# Altium schematic sheet 01-Chopper-CD.SchDoc
size C; DocumentNumber: 2; SheetNumber: 2; SheetTotal: 4
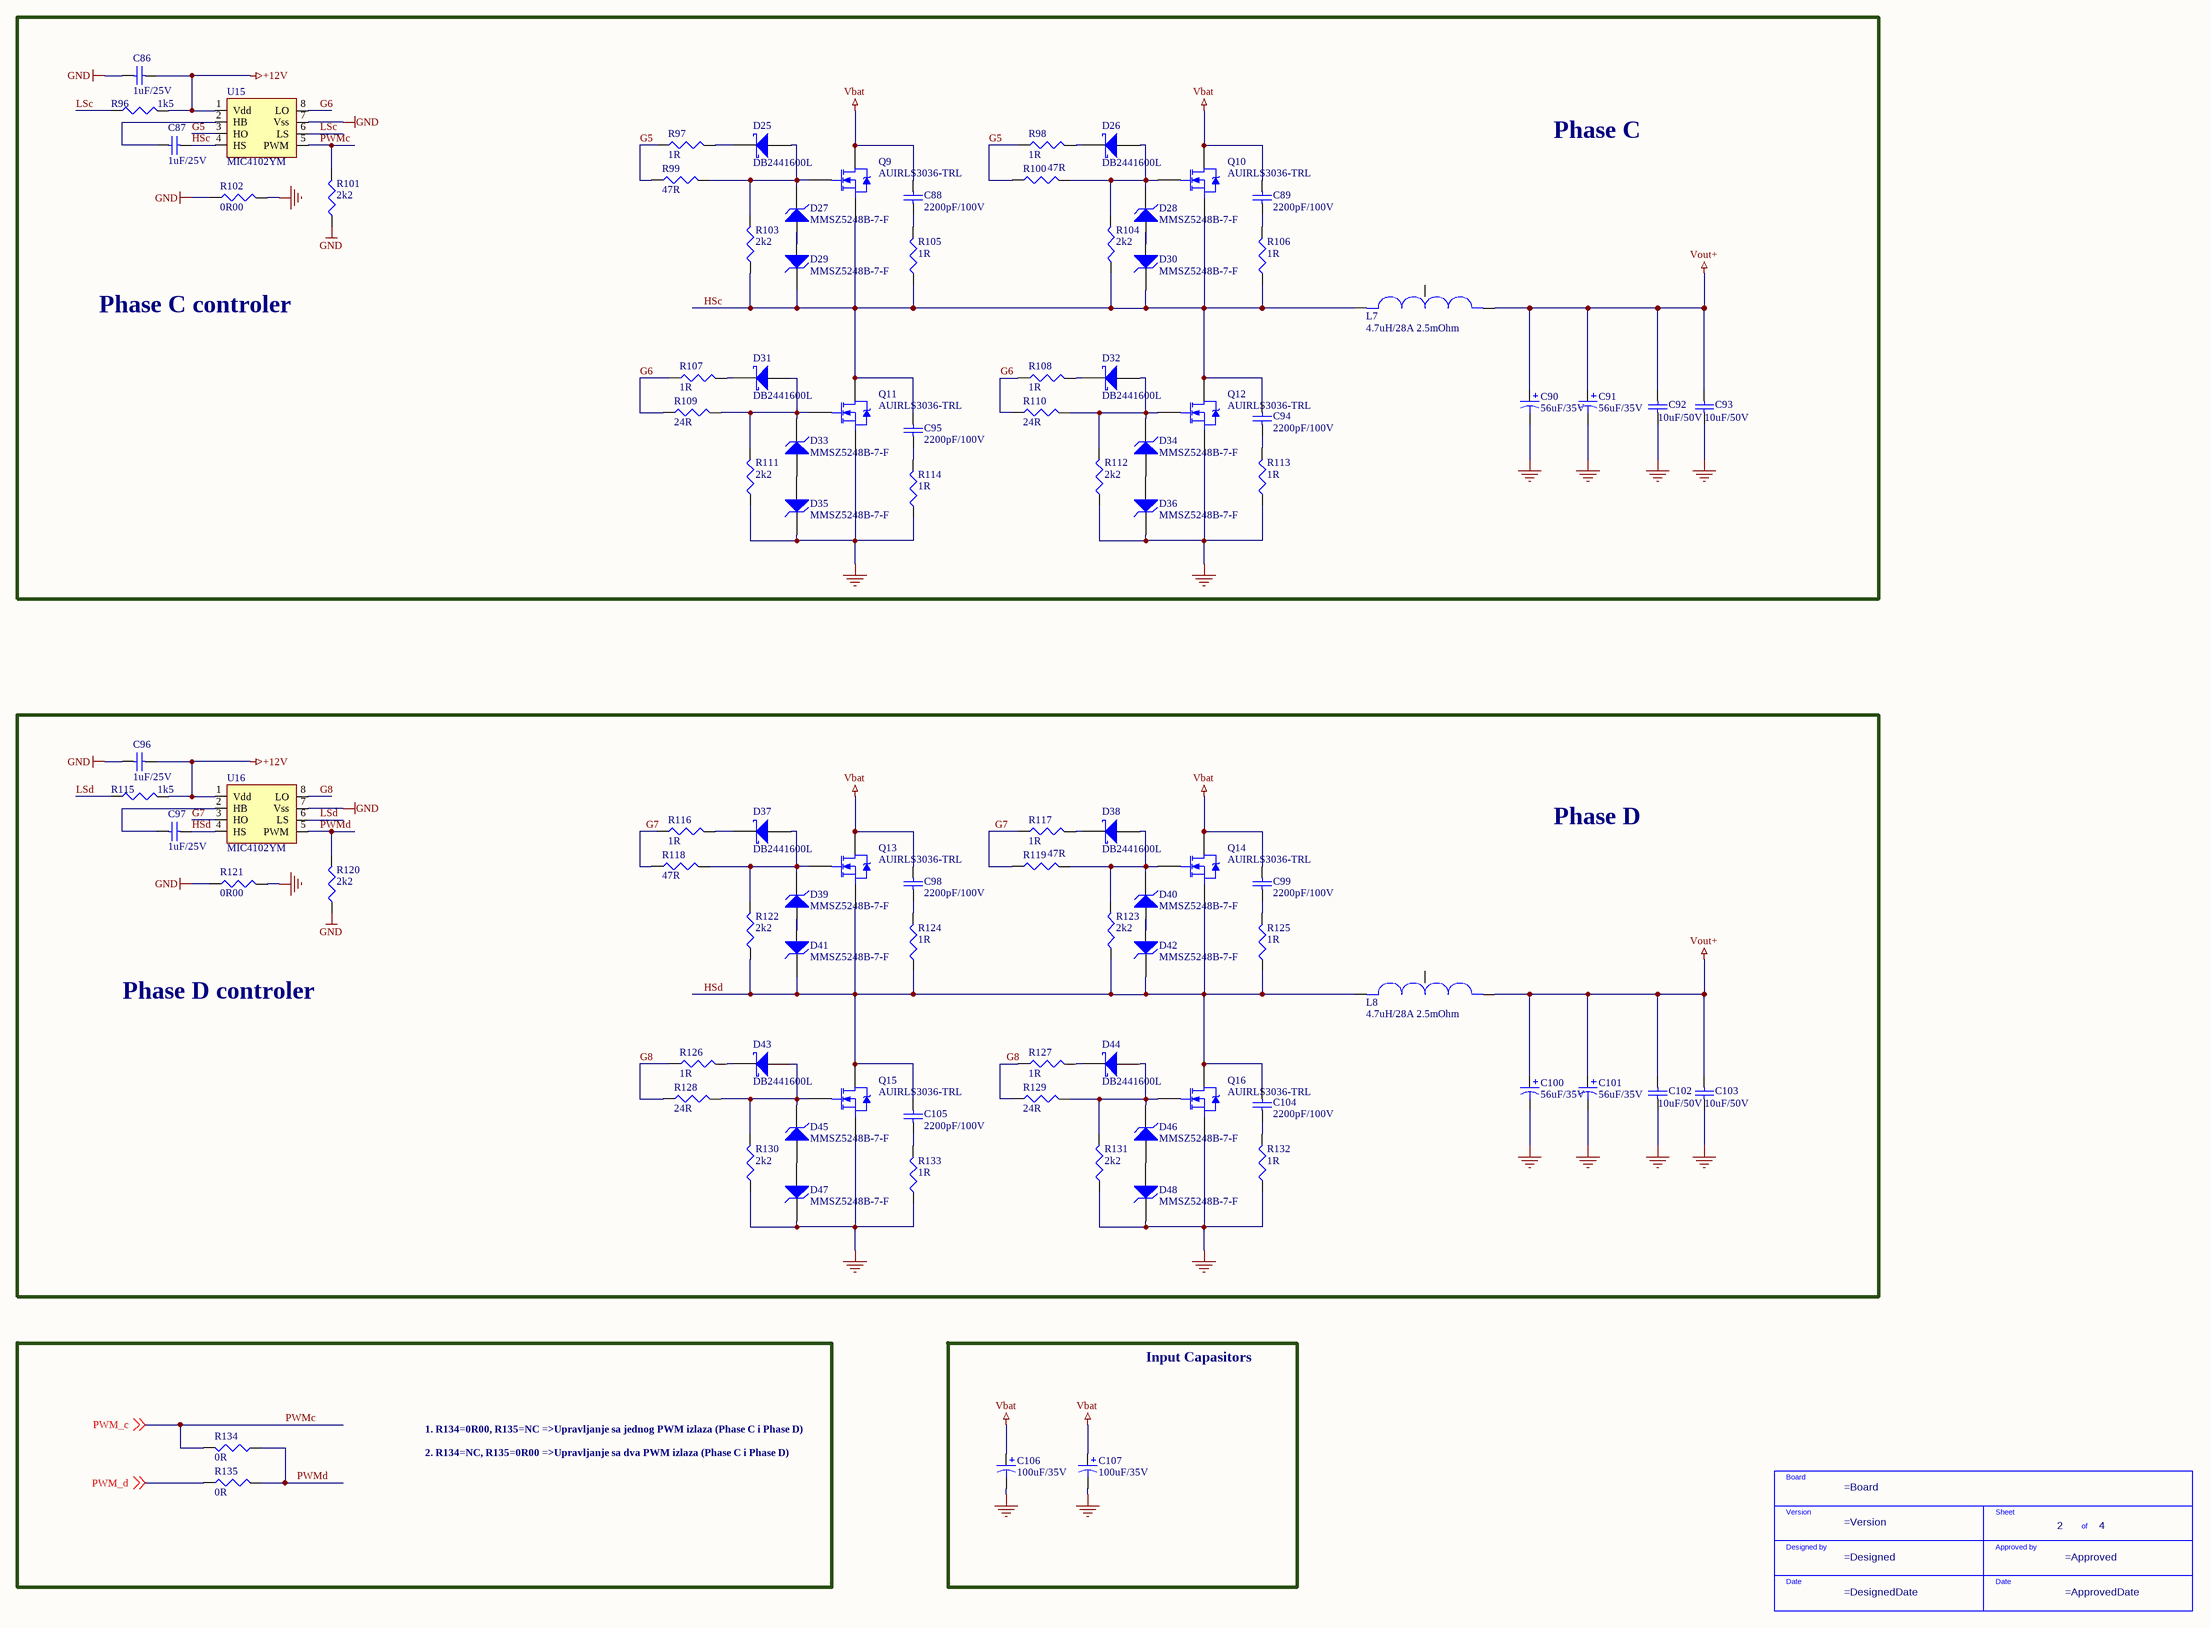
[diagram p0: 01-Chopper-CD.SchDoc]

## Parts
C86  1uF/25V  [CAPC2013X14N]
C87  1uF/25V  [CAPC2013X14N]
C88  2200pF/100V  [DiscCapacitorSnuber]
C89  2200pF/100V  [DiscCapacitorSnuber]
C90  56uF/35V  [CAPAE10184X100M]
C91  56uF/35V  [CAPAE10184X100M]
C92  10uF/50V  [CAPC3426X27N]
C93  10uF/50V  [CAPC3426X27N]
C94  2200pF/100V  [DiscCapacitorSnuber]
C95  2200pF/100V  [DiscCapacitorSnuber]
C96  1uF/25V  [CAPC2013X14N]
C97  1uF/25V  [CAPC2013X14N]
C98  2200pF/100V  [DiscCapacitorSnuber]
C99  2200pF/100V  [DiscCapacitorSnuber]
C100  56uF/35V  [CAPAE10184X100M]
C101  56uF/35V  [CAPAE10184X100M]
C102  10uF/50V  [CAPC3426X27N]
C103  10uF/50V  [CAPC3426X27N]
C104  2200pF/100V  [DiscCapacitorSnuber]
C105  2200pF/100V  [DiscCapacitorSnuber]
C106  100uF/35V  [CAPAE8884X86M]
C107  100uF/35V  [CAPAE8884X86M]
D25  DB2441600L  [DIOM4824X10N]
D26  DB2441600L  [DIOM4824X10N]
D27  MMSZ5248B-7-F  [DIOM3715X14N]
D28  MMSZ5248B-7-F  [DIOM3715X14N]
D29  MMSZ5248B-7-F  [DIOM3715X14N]
D30  MMSZ5248B-7-F  [DIOM3715X14N]
D31  DB2441600L  [DIOM4824X10N]
D32  DB2441600L  [DIOM4824X10N]
D33  MMSZ5248B-7-F  [DIOM3715X14N]
D34  MMSZ5248B-7-F  [DIOM3715X14N]
D35  MMSZ5248B-7-F  [DIOM3715X14N]
D36  MMSZ5248B-7-F  [DIOM3715X14N]
D37  DB2441600L  [DIOM4824X10N]
D38  DB2441600L  [DIOM4824X10N]
D39  MMSZ5248B-7-F  [DIOM3715X14N]
D40  MMSZ5248B-7-F  [DIOM3715X14N]
D41  MMSZ5248B-7-F  [DIOM3715X14N]
D42  MMSZ5248B-7-F  [DIOM3715X14N]
D43  DB2441600L  [DIOM4824X10N]
D44  DB2441600L  [DIOM4824X10N]
D45  MMSZ5248B-7-F  [DIOM3715X14N]
D46  MMSZ5248B-7-F  [DIOM3715X14N]
D47  MMSZ5248B-7-F  [DIOM3715X14N]
D48  MMSZ5248B-7-F  [DIOM3715X14N]
L7  4.7uH/28A 2.5mOhm  [BournsInductor_4.7uH]
L8  4.7uH/28A 2.5mOhm  [BournsInductor_4.7uH]
Q9  AUIRLS3036-TRL  [DPAK127P1524X483-7N]
Q10  AUIRLS3036-TRL  [DPAK127P1524X483-7N]
Q11  AUIRLS3036-TRL  [DPAK127P1524X483-7N]
Q12  AUIRLS3036-TRL  [DPAK127P1524X483-7N]
Q13  AUIRLS3036-TRL  [DPAK127P1524X483-7N]
Q14  AUIRLS3036-TRL  [DPAK127P1524X483-7N]
Q15  AUIRLS3036-TRL  [DPAK127P1524X483-7N]
Q16  AUIRLS3036-TRL  [DPAK127P1524X483-7N]
R96  1k5  [RESC2914X05N]
R97  1R  [RESC2914X05N]
R98  1R  [RESC2914X05N]
R99  47R  [RESC2914X05N]
R100  47R  [RESC2914X05N]
R101  2k2  [RESC2914X05N]
R102  0R00  [RESC2914X05N]
R103  2k2  [RESC2914X05N]
R104  2k2  [RESC2914X05N]
R105  1R  [RESC6432X08N]
R106  1R  [RESC6432X08N]
R107  1R  [RESC2914X05N]
R108  1R  [RESC2914X05N]
R109  24R  [RESC2914X05N]
R110  24R  [RESC2914X05N]
R111  2k2  [RESC2914X05N]
R112  2k2  [RESC2914X05N]
R113  1R  [RESC6432X08N]
R114  1R  [RESC6432X08N]
R115  1k5  [RESC2914X05N]
R116  1R  [RESC2914X05N]
R117  1R  [RESC2914X05N]
R118  47R  [RESC2914X05N]
R119  47R  [RESC2914X05N]
R120  2k2  [RESC2914X05N]
R121  0R00  [RESC2914X05N]
R122  2k2  [RESC2914X05N]
R123  2k2  [RESC2914X05N]
R124  1R  [RESC6432X08N]
R125  1R  [RESC6432X08N]
R126  1R  [RESC2914X05N]
R127  1R  [RESC2914X05N]
R128  24R  [RESC2914X05N]
R129  24R  [RESC2914X05N]
R130  2k2  [RESC2914X05N]
R131  2k2  [RESC2914X05N]
R132  1R  [RESC6432X08N]
R133  1R  [RESC6432X08N]
R134  0R  [R0805]
R135  0R  [R0805]
STB?  -  (value not drawn)  (graphical)
U15  MIC4102YM  [SOIC127P610X173-8N]
U16  MIC4102YM  [SOIC127P610X173-8N]

## Blocks framed on the sheet
Input Capasitors: C106 C107

## Nets
+12V: C86.2 C96.2 R96.2 R115.2 U15.1(Vdd) U16.1(Vdd)
GND: C86.1 C96.1 R101.1 R102.1 R120.1 R121.1 U15.7(Vss) U16.7(Vss)
P_GND: C90.2 C91.2 C92.1 C93.1 C100.2 C101.2 C102.1 C103.1 C106.2 C107.2 D35.2(K) D36.2(K) D47.2(K) D48.2(K) Q11.3(S) Q12.3(S) Q15.3(S) Q16.3(S) R102.2 R111.1 R112.1 R113.1 R114.1 R121.2 R130.1 R131.1 R132.1 R133.1
Vbat: C88.2 C89.2 C98.2 C99.2 C106.1 C107.1 Q9.2(D) Q10.2(D) Q13.2(D) Q14.2(D)
Vout+: C90.1 C91.1 C92.2 C93.2 C100.1 C101.1 C102.2 C103.2 L7.2 L8.2
G5: R97.1 R98.1 R99.1 R100.1 U15.3(HO)
G6: R107.1 R108.1 R109.1 R110.1 U15.8(LO)
G7: R116.1 R117.1 R118.1 R119.1 U16.3(HO)
G8: R126.1 R127.1 R128.1 R129.1 U16.8(LO)
HSc: C87.1 C94.2 C95.2 D29.2(K) D30.2(K) L7.1 Q9.3(S) Q10.3(S) Q11.2(D) Q12.2(D) R103.1 R104.1 R105.1 R106.1 U15.4(HS)
HSd: C97.1 C104.2 C105.2 D41.2(K) D42.2(K) L8.1 Q13.3(S) Q14.3(S) Q15.2(D) Q16.2(D) R122.1 R123.1 R124.1 R125.1 U16.4(HS)
LSc: R96.1 U15.6(LS)
LSd: R115.1 U16.6(LS)
PWM_d: R135.1 ; off-sheet PWM_d
PWMc: R101.2 R134.2 U15.5(PWM) ; off-sheet PWM_c  [also labelled PWM_c]
PWMd: R120.2 R134.1 R135.2 U16.5(PWM)
NetC87_2: C87.2 U15.2(HB)
NetC88_1: C88.1 R105.2
NetC89_1: C89.1 R106.2
NetC94_1: C94.1 R113.2
NetC95_1: C95.1 R114.2
NetC97_2: C97.2 U16.2(HB)
NetC98_1: C98.1 R124.2
NetC99_1: C99.1 R125.2
NetC104_1: C104.1 R132.2
NetC105_1: C105.1 R133.2
NetD25_1: D25.1(A) D27.2(K) Q9.1(G) R99.2 R103.2
NetD25_2: D25.2(K) R97.2
NetD26_1: D26.1(A) D28.2(K) Q10.1(G) R100.2 R104.2
NetD26_2: D26.2(K) R98.2
NetD27_1: D27.1(A) D29.1(A)
NetD28_1: D28.1(A) D30.1(A)
NetD31_1: D31.1(A) D33.2(K) Q11.1(G) R109.2 R111.2
NetD31_2: D31.2(K) R107.2
NetD32_1: D32.1(A) D34.2(K) Q12.1(G) R110.2 R112.2
NetD32_2: D32.2(K) R108.2
NetD33_1: D33.1(A) D35.1(A)
NetD34_1: D34.1(A) D36.1(A)
NetD37_1: D37.1(A) D39.2(K) Q13.1(G) R118.2 R122.2
NetD37_2: D37.2(K) R116.2
NetD38_1: D38.1(A) D40.2(K) Q14.1(G) R119.2 R123.2
NetD38_2: D38.2(K) R117.2
NetD39_1: D39.1(A) D41.1(A)
NetD40_1: D40.1(A) D42.1(A)
NetD43_1: D43.1(A) D45.2(K) Q15.1(G) R128.2 R130.2
NetD43_2: D43.2(K) R126.2
NetD44_1: D44.1(A) D46.2(K) Q16.1(G) R129.2 R131.2
NetD44_2: D44.2(K) R127.2
NetD45_1: D45.1(A) D47.1(A)
NetD46_1: D46.1(A) D48.1(A)

Not connected (* = marked no-connect by the designer): L7 3; L8 3

## Notes on the sheet
- Phase C
- Phase C controler
- Phase D
- Phase D controler
- 1. R134=0R00, R135=NC =>Upravljanje sa jednog PWM izlaza (Phase C i Phase D)
- 2. R134=NC, R135=0R00 =>Upravljanje sa dva PWM izlaza (Phase C i Phase D)
- (in symbol Schematic Title Block) Board; Version; Sheet; of; Designed by; Approved by; Date

## Library data of the parts
C86 C87 C96 C97 = CL21B105KAFNNNG: 1µF ±10% 25V Ceramic Capacitor X7R 0805 (2012 Metric); Manufacturer: Samsung Electro-Mechanics; Type: SMD; Manufacturer Part Number: CL21B105KAFNNNG; Package: CAPC2012X88N; Category: Capasitor; Max Rated Voltage: 25V; Temperature coefficient: X7R; Supplier1: Digi-key; Supplier part number: 1276-6469-2-ND; ComponentLink1Description: Datasheet; ComponentLink1URL: http://www.samsungsem.com/kr/support/product-search/mlcc/__icsFiles/afieldfile/2019/06/18/CL21B105KAFNNNG-19.pdf; Tolerance: 10%
C88 C89 C94 C95 C98 C99 C104 C105 = D222K25Y5PH63J5R: D222K25Y5PH63J5R -  Ceramic Disc Capacitor, 2200 pF, 100 V, D Series, ± 10%, Y5P, 5 mm; Manufacturer: Vishay; Max Rated Voltage: 100V; Type: THT; Manufacturer Part Number: D222K25Y5PH63J5R; Package: *; Category: Capasitor; Dielectric Characteristic: Y5P; Supplier1: Farnell; Supplier part number: 1827838; Tolerance: 10%; ComponentLink1Description: Datasheet; ComponentLink1URL: http://www.farnell.com/datasheets/2046069.pdf?_ga=2.161221557.908146518.1581324380-437978810.1505463394
C90 C91 C100 C101 = PCV1V560MCL1GS: 56µF 35V Aluminum Polymer Capacitor Radial, Can - SMD 31mOhm 3000 Hrs @ 105°C; Manufacturer: Nichicon; Ripple Current: 1.9A; ESR (Equivalent Series Resistance): 31mR; Capacitance: 56uF; Tolerance: 20%; Leakage Current: 700uA; Life (Hours): 2000Hour; Dissipation Factor: 0.12%; Supplier 1: Mouser; Manufacturer Part Number: PCV1V560MCL1GS; Stock 1: 2294; Pricing 1: 1=2.74, 10=2.25, 25=2.19, 100=1.75, 250=1.66, 500=1.19 (USD); Mount: Surface Mount; Case/Package: SMD/SMT; Min Operating Temperature: -55°C; Max Operating Temperature: 105°C; Packaging: Tape and Reel; Voltage Rating: 35V; Package Quantity: 1; Ripple Current (AC): 1.9A; Voltage Rating (DC): 35V; Termination: SMD/SMT; Diameter: 8mm; Length: 8.3mm; Height: 8.3mm; Width: 8.3mm; Height - Seated (Max): 0.394inch; REACH SVHC: No SVHC; Supplier Part Number 1: 647-RHS1V101MCN1GS; Category: Capacitors; ComponentLink1Description: Datasheet; ComponentLink1URL: https://eu.mouser.com/datasheet/2/293/e-pcv-884151.pdf
C92 C93 C102 C103 = UMK325C7106MM-T: 10µF ±20% 50V Ceramic Capacitor X7S 1210 (3225 Metric); Manufacturer: Taiyo Yuden; Type: SMD; Manufacturer Part Number: UMK325C7106MM-T; Package: CAPC3225X125N; Category: Capasitor; Max Rated Voltage: 50 V; Dielectric Characteristic: X7S; Supplier1: Digikey; Supplier part number: 587-1818-2-ND; Tolerance: 20%; ComponentLink1Description: Datasheet; ComponentLink1URL: https://media.digikey.com/pdf/Data%20Sheets/Taiyo%20Yuden%20PDFs%20URL%20links/UMK325C7106MM-T.pdf
C106 C107 = RHS1V101MCN1GS: NICHICON         RHS1V101MCN1GS             ALUMINUM ELECTROLYTIC CAPACITOR, 100UF, 20%, 35V, SMD; Ripple Current: 3A; ESR (Equivalent Series Resistance): 25mR; Leakage Current: 700uA; Life (Hours): 2000Hour; Dissipation Factor: 0.12%; Supplier 1: Mouser; Manufacturer: Nichicon; Manufacturer Part Number: RHS1V101MCN1GS; Stock 1: 2294; Pricing 1: 1=2.74, 10=2.25, 25=2.19, 100=1.75, 250=1.66, 500=1.19 (USD); Mount: Surface Mount; Case/Package: SMD/SMT; Min Operating Temperature: -55°C; Max Operating Temperature: 105°C; Packaging: Tape and Reel; Capacitance: 100uF; Tolerance: 20%; Voltage Rating: 35V; Package Quantity: 1; Ripple Current (AC): 3A; Voltage Rating (DC): 35V; Termination: SMD/SMT; Diameter: 8mm; Length: 8.7mm; Height: 8.3mm; Width: 8.3mm; Height - Seated (Max): 0.354inch; REACH SVHC: No SVHC; ComponentLink1URL: https://eu.mouser.com/datasheet/2/293/e-rhs_rha-1513422.pdf; ComponentLink1Description: Datasheet; Supplier Part Number 1: 647-RHS1V101MCN1GS; Category: Capacitors
D25 D26 D31 D32 D37 D38 D43 D44 = DB2441600L: Diodes - General Purpose, Power, Switching Schottky Barrier Diode; Manufacturer: Panasonic; Peak Reverse Voltage: 40 V; Max Surge Current: 50 A; Forward Current: 3 A; Type: SMD; Manufacturer Part Number: DB2441600L; Package: *; Category: Shottky; Supplier1: Mouser; Supplier part number: 667-DB2441600L; ComponentLink1Description: Datasheet; ComponentLink1URL: https://eu.mouser.com/datasheet/2/315/DB2441600L_E-1141476.pdf
D27-D30 D33-D36 D39-D42 D45-D48 = MMSZ5248B-7-F: Diodes Inc, 18V Zener Diode 5% 500 mW SMT 2-Pin SOD-123; Manufacturer: Diode Zetex; Maximum Power Dissipation: 500 mW; Test Current: 7 mA; Type: SMD; Manufacturer Part Number: MMSZ5248B-7-F; Package: SOD3716X135N; Category: Zener diode; Nominal Zener Voltage: 18 V; Supplier1: RS Components; Supplier part number: 121-9610; ComponentLink1Description: Datasheet; ComponentLink1URL: https://eu.mouser.com/datasheet/2/115/ds18010-38133.pdf
L7 L8 = PQ2617BHA-4R7K: FIXED IND 4.7UH 28A 2.5MOHM SMD; Manufacturer: Bourns; Core Material: Ferrite; Tolerance: 10%; Saturation Current: 61.2A; Shielding: Shielded; DC Resistance (DCR): 2.5mR; Self Resonant Frequency: 30MHz; Test Frequency: 100kHz; Supplier 1: Mouser; Supplier Part Number 1: 652-PQ2617BHA-4R7K; Manufacturer Part Number: PQ2617BHA-4R7K; Stock 1: 790; Pricing 1: 1=3.71, 5=3.56, 10=3.41, 25=3.1, 50=2.6, 100=2.23 (USD); Mount: Surface Mount; Case/Package: Nonstandard; Min Operating Temperature: -40°C; Max Operating Temperature: 155°C; Composition: Wirewound; Packaging: Tray; Inductance: 4.7uH; Current Rating: 28A; Ratings: AEC-Q200; ComponentLink1URL: https://www.bourns.com/docs/Product-Datasheets/PQ2617.pdf?src-supplier=Digi-Key; ComponentLink1Description: https://www.bourns.com/docs/Product-Datasheets/PQ2617.pdf?src-supplier=Digi-Key; Category: Fixed Inductors
Q9-Q16 = AUIRLS3036-7TRL: Trans MOSFET N-CH 60V 300A Automotive 7-Pin(6+Tab) D2PAK T/R; Manufacturer: International Rectifier; Rise Time: 540ns; Rds On Max: 1.9mR; Input Capacitance: 11.27nF; Drain to Source Resistance: 2.2mR; Power Dissipation: 380W; Number of Elements: 1; Turn-On Delay Time: 81ns; Turn-Off Delay Time: 89ns; Fall Time: 170ns; Gate to Source Voltage (Vgs): 16V; Manufacturer Part Number: AUIRLS3036-7TRL; Mount: Surface Mount; Case/Package: D2PAK; Number of Pins: 7; Min Operating Temperature: -55°C; Max Operating Temperature: 175°C; Packaging: Tape and Reel; Package Quantity: 800; Continuous Drain Current (ID): 300A; Drain to Source Breakdown Voltage: 60V; Drain to Source Voltage (Vdss): 60V; Max Power Dissipation: 380W; Radiation Hardening: No; ComponentLink1URL: http://www.irf.com/product-info/datasheets/data/auirls3036-7p.pdf?src-supplier=Digi-Key; ComponentLink1Description: http://www.irf.com/product-info/datasheets/data/auirls3036-7p.pdf?src-supplier=Digi-Key; ComponentLink2URL: http://www.irf.com/product-info/datasheets/data/auirls3036-7p.pdf?src-supplier=Avnet; ComponentLink2Description: http://www.irf.com/product-info/datasheets/data/auirls3036-7p.pdf?src-supplier=Avnet; ComponentLink3URL: http://www.irf.com/product-info/datasheets/data/auirls3036-7p.pdf?src-supplier=Avnet+Europe; ComponentLink3Description: http://www.irf.com/product-info/datasheets/data/auirls3036-7p.pdf?src-supplier=Avnet+Europe; Category: MOSFET
R96 R115 = CRCW08051K50FKEA: Res Thick Film 0805 1.5K Ohm 1% 1/8W ±100ppm/°C Molded SMD Paper T/R; Manufacturer: Vishay; Power rating: 0.125 W; Manufacturer Part Number: CRCW08051K50FKEA; Package: RESC2012X60N; Category: Resistor; Resistance: 1k5; Tolerance: 1%; Number of pins: 2; Type: SMD; Supplier1: Future electronics; Supplier part number: CRCW08051K50FKEA; ComponentLink1Description: Datasheet; ComponentLink1URL: http://www.vishay.com/docs/20035/dcrcwe3.pdf
R97 R98 R107 R108 R116 R117 R126 R127 = CRCW08051R00FKEA: Res Thick Film 0805 1 Ohm 1% 1/8W ±100ppm/°C Molded SMD SMD Paper T/R; Manufacturer: Vishay; Power rating: 0.125W; Manufacturer Part Number: CRCW08051R00FKEA; Package: RESC1608X50N; Category: Resistor; Resistance: 1R; Tolerance: 1%; Voltage rating: *; Type: SMD; Supplier1: Avnet Abacus; Supplier part number: CRCW08051R00FKEA; ComponentLink1Description: Datasheet; ComponentLink1URL: http://www.vishay.com/docs/20035/dcrcwe3.pdf
R99 R100 R118 R119 = RC0805FR-0747RL: RC Series 0805 0.125 W 47 Ohm ±1% ±100 ppm/°C SMT Thick Film Chip Resistor; Manufacturer: Yageo; Power rating: 0.125W; Resistance: 24R; Manufacturer Part Number: RC0805FR-0747RL; Package: RESC1608X50N; Category: Resistor; Tolerance: 1%; Number of pins: 2; Type: SMD; Supplier1: Future electronics; Supplier part number: RC0805FR-0747RL; ComponentLink1Description: Datasheet; ComponentLink1URL: https://www.yageo.com/upload/media/product/productsearch/datasheet/rchip/PYu-RC_Group_51_RoHS_L_10.pdf
R101 R103 R104 R111 R112 R120 R122 R123 R130 R131 = RC0805FR-072K2L: RC Series 0805 0.125 W 2.2 kOhm ±1% ±100 ppm/°C SMT Thick Film Chip Resistor; Manufacturer: Yageo; Power rating: 0.125W; Manufacturer Part Number: RC0805FR-072K2L; Package: RESC1608X50N; Category: Resistor; Resistance: 2k2; Tolerance: 1%; Number of pins: 2; Type: SMD; Supplier1: Future electronics; Supplier part number: RC0805FR-072K2L; ComponentLink1Description: Datasheet; ComponentLink1URL: http://www.yageo.ru/pdf/RC0805.pdf
R102 R121 = RC0805FR-070RL: Res Thick Film 0805 0 Ohm Jumper Molded SMD Paper T/R; Manufacturer: Yageo; Power rating: 0.125 W; Tolerance: 1%; Manufacturer Part Number: RC0805FR-070RL; Package: RESC2012X60N; Category: Resistor; Resistance: 0R00; Number of pins: 2; Type: SMD; Supplier1: Avnet abacus; Supplier part number: RC0805FR-070RL; ComponentLink1Description: Datasheet; ComponentLink1URL: https://www.yageo.com/documents/recent/PYu-RC_Group_51_RoHS_L_2.pdf
R105 R106 R113 R114 R124 R125 R132 R133 = CR2512-J/-1R0ELF: Thick Film Resistors - SMD CHIP RESISTOR; Manufacturer: Bourns; Power rating: 1W; Tolerance: 5%; Voltage rating: 200V; Manufacturer Part Number: CR2512-J/-1R0ELF; Package: RESC2012X60N; Category: Resistor; Resistance: 1R; Type: SMD; Supplier1: Mouser; Supplier part number: 652-CR2512-J/-1R0ELF; ComponentLink1Description: Datasheet; ComponentLink1URL: https://eu.mouser.com/datasheet/2/54/cr2010-777415.pdf
R109 R110 R128 R129 = CRCW080524R0FKEA: Res Thick Film 0805 24 Ohm 1% 1/8W ±100ppm/°C Molded SMD Paper T/R; Manufacturer: Vishay; Power rating: 0.125W; Manufacturer Part Number: CRCW080524R0FKEA; Package: RESC1608X50N; Category: Resistor; Resistance: 24R; Tolerance: 1%; Number of pins: 2; Type: SMD; Supplier1: Avnet abacus; Supplier part number: CRCW080524R0FKEA; ComponentLink1Description: Datasheet; ComponentLink1URL: http://www.vishay.com/docs/20035/dcrcwe3.pdf
R134 R135 = CRCW08050000Z0EA: RES 0R00 0805 0.125W; Manufacturer: Vishay Dale; Resistance (Ohms): 0.0; Tolerance: Jumper; Power (Watts): 0.125W, 1/8W; .PCBChecked: BP; Manufacturer Part Number: CRCW08050000Z0EA; RoHS: RoHS Compliant; Category: Resistors; Packaging: Cut Tape (CT); Part Status: Active; Composition: Thick Film; Features: Automotive AEC-Q200; Temperature Coefficient: -; Operating Temperature: -55°C ~ 155°C; Package: RESC2012X60N; Supplier Device Package: 0805; Size / Dimension: 0.079" L x 0.049" W (2.00mm x 1.25mm); Height - Seated (Max): 0.020" (0.50mm); Failure Rate: -; ComponentLink1URL: http://www.vishay.com/docs/20035/dcrcwe3.pdf; ComponentLink1Description: Datasheet; Supplier 1: Future Electronics; Supplier Part Number 1: CRCW08050000Z0EA; Type: SMD; .SCHChecked: BP
STB? = Schematic Title Block: Schematic Title Block Template
U15 U16 = MIC4102YM: Gate Drivers 100V HalfBridge MOSFET Driver with Anti-Shoot-through Circuitry; Manufacturer: Microchip; Max Output Current: 3A; Max Supply Voltage: 16V; Min Supply Voltage: 9V; Number of Outputs: 2; Rise Time: 10ns; Nominal Supply Current: 3mA; Channel Type: Synchronous; Fall Time: 6ns; Supplier 1: RSComponents; Manufacturer Part Number: MIC4102YM; Stock 1: 0; Mount: Surface Mount; Case/Package: SOIC; Number of Pins: 8; Min Operating Temperature: -40°C; Max Operating Temperature: 125°C; Packaging: Rail/Tube; Output Current: 3A; Package Quantity: 95; Number of Drivers: 2; Termination: SMD/SMT; Length: 4.93mm; Height: 1.48mm; Width: 3.94mm; Lead Free: Lead Free; REACH SVHC: No SVHC; ComponentLink1URL: http://www.farnell.com/datasheets/83997.pdf?src-supplier=Farnell; ComponentLink1Description: http://www.farnell.com/datasheets/83997.pdf?src-supplier=Farnell; ComponentLink2URL: http://datasheet.iiic.cc/micrel/MIC4102YM.pdf?src-supplier=IIIC; ComponentLink2Description: http://datasheet.iiic.cc/micrel/MIC4102YM.pdf?src-supplier=IIIC; Supplier Part Number 1: 9101884; Category: MOSFET Drivers